# EAGLE schematic Fishbot_receiver (EAGLE 8.5.0)
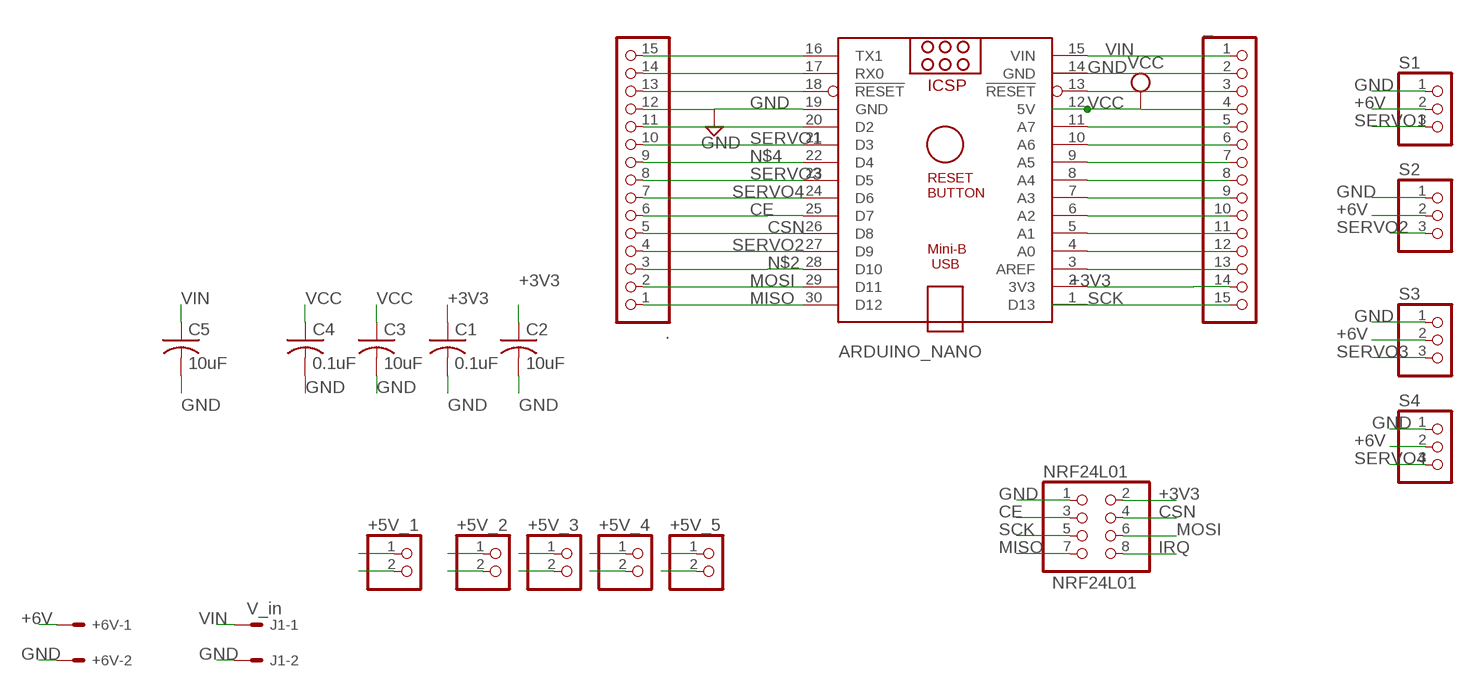
[diagram p0: schematic, sheet 1]

## Parts
+5V_1  PINHD-1X2  [1X02]
+5V_2  PINHD-1X2  [1X02]
+5V_3  PINHD-1X2  [1X02]
+5V_4  PINHD-1X2  [1X02]
+5V_5  PINHD-1X2  [1X02]
+6V  22-27-2021-02  [6410-02]
.  PINHD-1X15  [1X15]
_  PINHD-1X15  [1X15]
ARDUINO_NANO  ARDUINO_NANO  [ARDUINO_NANO]
C1  0.1uF  C-USC1206  [C1206]
C2  10uF  C-USC1206  [C1206]
C3  10uF  C-USC1206  [C1206]
C4  0.1uF  C-USC1206  [C1206]
C5  10uF  C-USC1206  [C1206]
J1  V_in  22-27-2021-02  [6410-02]
NRF24L01  PINHD-2X4  [2X04]
S1  PINHD-1X3  [1X03]
S2  PINHD-1X3  [1X03]
S3  PINHD-1X3  [1X03]
S4  PINHD-1X3  [1X03]

## Nets
+3V3: _.14 ARDUINO_NANO.2(3V3) C1.1 C2.1 NRF24L01.2
+6V: +6V.1 S1.2 S2.2 S3.2 S4.2
CE: ..6 ARDUINO_NANO.25(D7) NRF24L01.3
CSN: ..5 ARDUINO_NANO.26(D8) NRF24L01.4
GND: +5V_1.2 +5V_2.2 +5V_3.2 +5V_4.2 +5V_5.2 +6V.2 ..12 _.2 ARDUINO_NANO.14(GND) ARDUINO_NANO.19(GND) C1.2 C2.2 C3.2 C4.2 C5.2 J1.2 NRF24L01.1 S1.1 S2.1 S3.1 S4.1
IRQ: NRF24L01.8
MISO: ..1 ARDUINO_NANO.30(D12) NRF24L01.7
MOSI: ..2 ARDUINO_NANO.29(D11) NRF24L01.6
N$2: ..3 ARDUINO_NANO.28(D10)
N$4: ..9 ARDUINO_NANO.22(D4)
N$12: ..11 ARDUINO_NANO.20(D2)
N$14: ..13 ARDUINO_NANO.18(!RESET)
N$15: ..14 ARDUINO_NANO.17(RX0)
N$16: ..15 ARDUINO_NANO.16(TX1)
N$19: _.3 ARDUINO_NANO.13(!RESET)
N$21: _.5 ARDUINO_NANO.11(A7)
N$22: _.6 ARDUINO_NANO.10(A6)
N$23: _.7 ARDUINO_NANO.9(A5)
N$24: _.8 ARDUINO_NANO.8(A4)
N$25: _.9 ARDUINO_NANO.7(A3)
N$26: _.10 ARDUINO_NANO.6(A2)
N$27: _.11 ARDUINO_NANO.5(A1)
N$28: _.12 ARDUINO_NANO.4(A0)
N$29: _.13 ARDUINO_NANO.3(AREF)
SCK: _.15 ARDUINO_NANO.1(D13) NRF24L01.5
SERVO1: ..10 ARDUINO_NANO.21(D3) S1.3
SERVO2: ..4 ARDUINO_NANO.27(D9) S2.3
SERVO3: ..8 ARDUINO_NANO.23(D5) S3.3
SERVO4: ..7 ARDUINO_NANO.24(D6) S4.3
VCC: +5V_1.1 +5V_2.1 +5V_3.1 +5V_4.1 +5V_5.1 _.4 ARDUINO_NANO.12(5V) C3.1 C4.1
VIN: _.1 ARDUINO_NANO.15(VIN) C5.1 J1.1

## Library data of the parts
+5V_1-+5V_5 = pinhead:PINHD-1X2: PIN HEADER
+6V J1 = con-molex:22-?-02: CONNECTOR wire to board 2.54 mm (.1 inch) pitch header; MF: MOLEX; OC_FARNELL: unknown; OC_NEWARK: unknown
. _ = pinhead:PINHD-1X15: PIN HEADER
ARDUINO_NANO = ArduinoNanoV30:ARDUINO_NANO: Arduino Nano V3.0 Overview: The Arduino Nano is a small, complete, and breadboard-friendly board based on the ATmega328 (Arduino Nano 3.x) or ATmega168 (Arduino Nano 2.x). It has more or less the same functionality of the Arduino Duemilanove, but in a different package. It lacks only a DC power jack, and works with a Mini-B USB cable instead of a standard one. The Nano was designed and is being produced by Gravitech. Specifications: Microcontroller Atmel ATmega168 or ATmega328 Operating Voltage (logic level) 5 V Input Voltage (recommended) 7-12 V Input Voltage (limits) 6-20 V Digital I/O Pins 14 (of which 6 provide PWM output) Analog Input Pins 8 DC Current per I/O Pin 40 mA Flash Memory 16 KB (ATmega168) or 32 KB (ATmega328) of which 2 KB used by bootloader SRAM 1 KB (ATmega168) or 2 KB (ATmega328) EEPROM 512 bytes (ATmega168) or 1 KB (ATmega328) Clock Speed 16 MHz Dimensions 0.73" x 1.70" Length 45 mm Width 18 mm Weigth 5 g Power: The Arduino Nano can be powered via the Mini-B USB connection, 6-20V unregulated external power supply (pin 30), or 5V regulated external power supply (pin 27). The power source is automatically selected to the highest voltage source. Memory: The ATmega168 has 16 KB of flash memory for storing code (of which 2 KB is used for the bootloader); the ATmega328 has 32 KB, (also with 2 KB used for the bootloader). The ATmega168 has 1 KB of SRAM and 512 bytes of EEPROM (which can be read and written with the EEPROM library); the ATmega328 has 2 KB of SRAM and 1 KB of EEPROM. Input and Output: Each of the 14 digital pins on the Nano can be used as an input or output, using pinMode(), digitalWrite(), and digitalRead() functions. They operate at 5 volts. Each pin can provide or receive a maximum of 40 mA and has an internal pull-up resistor (disconnected by default) of 20-50 kOhms. In addition, some pins have specialized functions. Visit Arduino - ArduinoBoardNano <https://www.arduino.cc/en/Main/ArduinoBoardNano>
C1-C5 = rcl:C-US: CAPACITOR, American symbol; SPICEPREFIX: C
NRF24L01 = pinhead:PINHD-2X4: PIN HEADER
S1-S4 = pinhead:PINHD-1X3: PIN HEADER